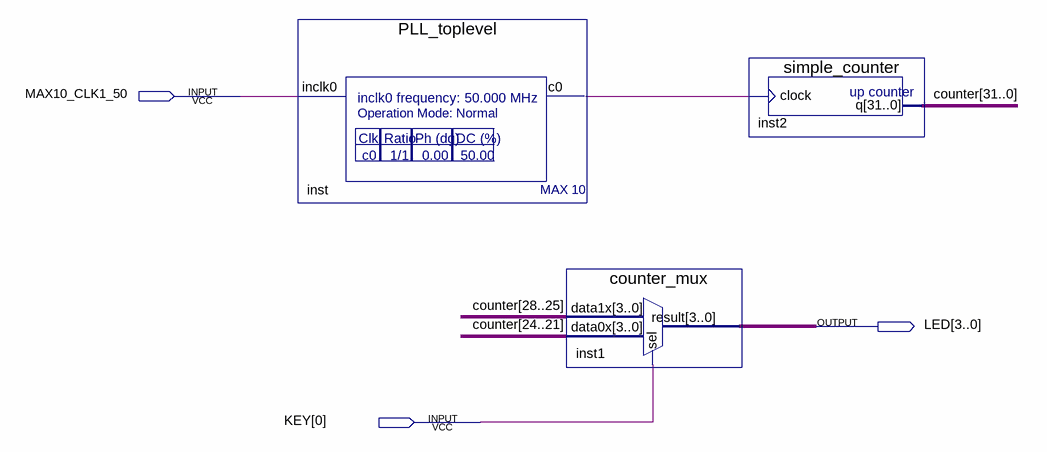
[diagram p0: schematic sheet]
// Quartus schematic toplevel.bdf as structural Verilog: 3 symbols, 3 pins
module toplevel (
  input  MAX10_CLK1_50,
  input  [0:0] KEY,
  output [3:0] LED
);

  wire inst_c0;
  wire [31:0] counter;

  PLL_toplevel inst (.inclk0(MAX10_CLK1_50), .c0(inst_c0));
  counter_mux inst1 (.data1x(counter[28:25]), .data0x(counter[24:21]), .sel(KEY[0]), .result(LED));
  simple_counter inst2 (.clock(inst_c0), .q(counter));
endmodule
